# Altium project MainBoard.PrjPCB
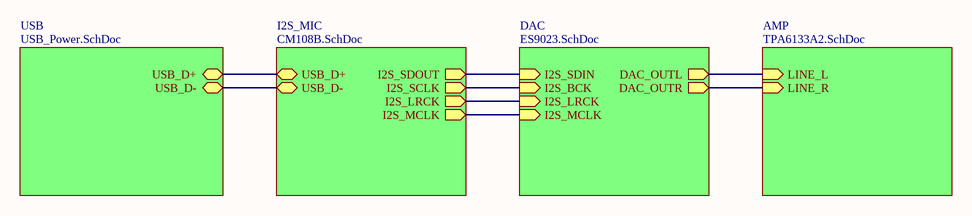
[diagram p0: Root.SchDoc]
5 sheets, 87 parts. Net scope: hierarchical (ports join the sheet entries above them; power ports are global).
Board file: MainBoard.PcbDoc
Sheets:
  Root.SchDoc
    USB = USB_Power.SchDoc
    I2S_MIC = CM108B.SchDoc
    AMP = TPA6133A2.SchDoc
    DAC = ES9023.SchDoc

## Sheet Root.SchDoc
size A4

### Sub-sheets
AMP = TPA6133A2.SchDoc: LINE_R (in), LINE_L (in)
DAC = ES9023.SchDoc: I2S_MCLK (in), I2S_LRCK (in), DAC_OUTL (out), DAC_OUTR (out), I2S_SDIN (in), I2S_BCK (in)
I2S_MIC = CM108B.SchDoc: USB_D-, I2S_SDOUT (out), USB_D+, I2S_MCLK (out), I2S_LRCK (out), I2S_SCLK (out)
USB = USB_Power.SchDoc: USB_D-, USB_D+

### Nets
BCK: sheet I2S_MIC/I2S_SCLK, sheet DAC/I2S_BCK
LRCK: sheet I2S_MIC/I2S_LRCK, sheet DAC/I2S_LRCK
MCLK: sheet I2S_MIC/I2S_MCLK, sheet DAC/I2S_MCLK
SDI: sheet I2S_MIC/I2S_SDOUT, sheet DAC/I2S_SDIN
NetC21_1: sheet AMP/LINE_L, sheet DAC/DAC_OUTL
NetC27_2: sheet AMP/LINE_R, sheet DAC/DAC_OUTR
NetESD1_6: sheet USB/USB_D+, sheet I2S_MIC/USB_D+
NetESD1_7: sheet USB/USB_D-, sheet I2S_MIC/USB_D-

## Sheet USB_Power.SchDoc
size A4
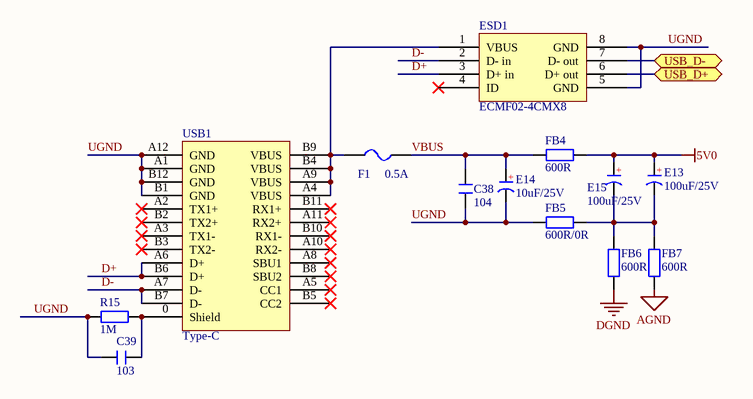
[diagram p1: USB_Power.SchDoc]

### Parts
C38  104  [C 0603_L]
C39  103  [C 0603_L]
E13  100uF/25V  [CD D(7343)]
E14  10uF/25V  [CD A(3216)]
E15  100uF/25V  [CD D(7343)]
ESD1  ECMF02-4CMX8  [QFN8L]
F1  0.5A  [FU 1206]
FB4  600R  [R 0805_L]
FB5  600R/0R  [R 0805_L]
FB6  600R  [R 0805_L]
FB7  600R  [R 0805_L]
R15  1M  [R 0603_L]
USB1  Type-C  [USB-TYPE-C_16PIN-MALE-TYPE-C-31-M-12]

### Ports
USB_D+, USB_D-

### Nets
5V0: E13.1(A) E15.1(A) FB4.2
AGND: FB7.1
DGND: FB6.1
D+: ESD1.3(D+_in) USB1.A6(D+) USB1.B6(D+)
D-: ESD1.2(D-_in) USB1.A7(D-) USB1.B7(D-)
UGND: C38.1 C39.2 E14.2(K) ESD1.5(GND) ESD1.8(GND) FB5.1 R15.2 USB1.A1(GND) USB1.A12(GND) USB1.B1(GND) USB1.B12(GND)
VBUS: C38.2 E14.1(A) F1.2 FB4.1
NetC39_1: C39.1 R15.1 USB1.0(Shield)
NetE13_2: E13.2(K) E15.2(K) FB5.2 FB6.2 FB7.2
NetESD1_1: ESD1.1(VBUS) F1.1 USB1.A4(VBUS) USB1.A9(VBUS) USB1.B4(VBUS) USB1.B9(VBUS)
NetESD1_6: ESD1.6(D+_out) ; port USB_D+
NetESD1_7: ESD1.7(D-_out) ; port USB_D-

Not connected (* = marked no-connect by the designer): ESD1 4(ID)*; USB1 A2(TX1+)* A3(TX1-)* A5(CC1)* A8(SBU1)* A10(RX2-)* A11(RX2+)* B2(TX2+)* B3(TX2-)* B5(CC2)* B8(SBU2)* B10(RX1-)* B11(RX1+)*

### Notes on the sheet
- (in symbol CT) +

### Library data of the parts
C38 C39 = C: 贴片电容; BOM名称: 无极性贴片电容; 优秀评价可免费更新: 联系淘宝ID：黄晶宝石，获取更新版封装库; 卖家免费技术支持，联系售后: 唯一出售店铺网址https://shop463601444.taobao.com; 本封装库来自淘宝卖家 ID：黄晶宝石: 其他店铺购入均为盗版，请立即申请退款
E13-E15 = CT: 贴片钽电容; 优秀评价可免费更新: 联系淘宝ID：黄晶宝石，获取更新版封装库; 卖家免费技术支持，联系售后: 唯一出售店铺网址https://shop463601444.taobao.com; 本封装库来自淘宝卖家 ID：黄晶宝石: 其他店铺购入均为盗版，请立即申请退款; BOM名称: 贴片钽电容
ESD1 = ECMF02-4CMX8: Common mode filter with ESD protection for USB 2.0 interface
F1 = FU: 贴片保险丝; 版权归属: 封装库来自淘宝卖家 ID：黄晶宝石; 优秀评价可免费更新: 联系淘宝ID：黄晶宝石，获取更新版封装库; 卖家免费技术支持，联系售后: 唯一出售店铺网址https://shop463601444.taobao.com; 封装库来自淘宝卖家 ID：黄晶宝石: 其他店铺购入均为盗版，请立即申请退款; BOM名称: 贴片保险丝
FB4-FB7 R15 = R: 贴片电阻; 优秀评价可免费更新: 联系淘宝ID：黄晶宝石，获取更新版封装库; 卖家免费技术支持，联系售后: 唯一出售店铺网址https://shop463601444.taobao.com; 本封装库来自淘宝卖家 ID：黄晶宝石: 其他店铺购入均为盗版，请立即申请退款; BOM名称: 贴片电阻

## Sheet CM108B.SchDoc
size A4
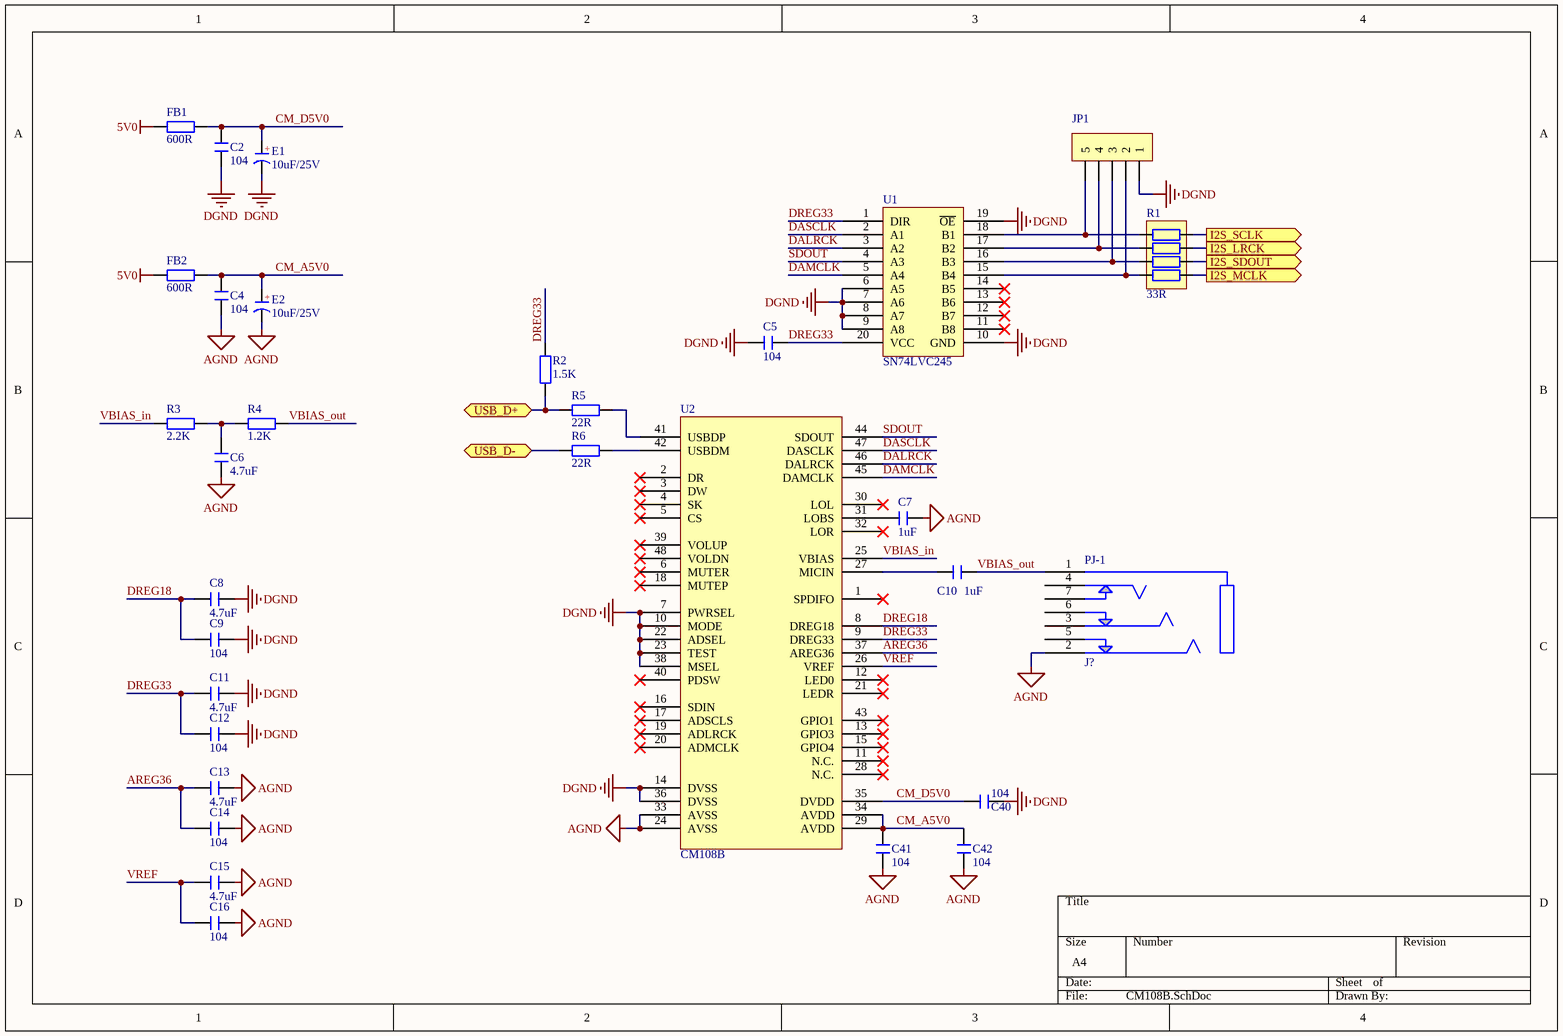
[diagram p2: CM108B.SchDoc]

### Parts
C2  104  [C 0603_L]
C4  104  [C 0603_L]
C5  104  [C 0603_L]
C6  4.7uF  [C 0603_L]
C7  1uF  [C 0603_L]
C8  4.7uF  [C 0603_L]
C9  104  [C 0603_L]
C10  1uF  [WIMA 1uF]
C11  4.7uF  [C 0603_L]
C12  104  [C 0603_L]
C13  4.7uF  [C 0603_L]
C14  104  [C 0603_L]
C15  4.7uF  [C 0603_L]
C16  104  [C 0603_L]
C40  104  [C 0603_L]
C41  104  [C 0603_L]
C42  104  [C 0603_L]
E1  10uF/25V  [CD A(3216)]
E2  10uF/25V  [CD A(3216)]
FB1  600R  [R 0805_L]
FB2  600R  [R 0805_L]
JP1  HDR-1X5  [HDR2.54-LI-5P]  (value not drawn)
PJ-1  J?  [PJ-393-7A]
R1  33R  [RCA-8P4R-0402]
R2  1.5K  [R 0603_L]
R3  2.2K  [R 0603_L]
R4  1.2K  [R 0603_L]
R5  22R  [R 0603_L]
R6  22R  [R 0603_L]
U1  SN74LVC245  [TSSOP20_N]
U2  CM108B  [LQFP48_N]

### Ports
I2S_LRCK (out), I2S_MCLK (out), I2S_SCLK (out), I2S_SDOUT (out), USB_D+, USB_D-

### Nets
5V0: FB1.1 FB2.1
AGND: C4.1 C6.2 C7.1 C13.1 C14.2 C15.1 C16.2 C41.2 C42.1 E2.2(K) PJ-1.2 U2.24(AVSS) U2.33(AVSS)
DGND: C2.1 C5.1 C8.1 C9.2 C11.1 C12.2 C40.2 E1.2(K) JP1.1 U1.6(A5) U1.7(A6) U1.8(A7) U1.9(A8) U1.10(GND) U1.19(~{OE}) U2.7(PWRSEL) U2.10(MODE) U2.14(DVSS) U2.22(ADSEL) U2.23(TEST) U2.36(DVSS) U2.38(MSEL)
AREG36: C13.2 C14.1 U2.37(AREG36)
BCK: R1.4 ; port I2S_SCLK
CM_A5V0: C4.2 C41.1 C42.2 E2.1(A) FB2.2 U2.29(AVDD) U2.34(AVDD)
CM_D5V0: C2.2 C40.1 E1.1(A) FB1.2 U2.35(DVDD)
DALRCK: U1.3(A2) U2.46(DALRCK)
DAMCLK: U1.5(A4) U2.45(DAMCLK)
DASCLK: U1.2(A1) U2.47(DASCLK)
DREG18: C8.2 C9.1 U2.8(DREG18)
DREG33: C5.2 C11.2 C12.1 R2.2 U1.1(DIR) U1.20(VCC) U2.9(DREG33)
LRCK: R1.3 ; port I2S_LRCK
MCLK: R1.1 ; port I2S_MCLK
SDI: R1.2 ; port I2S_SDOUT
SDOUT: U1.4(A3) U2.44(SDOUT)
VBIAS_in: R3.1 U2.25(VBIAS)
VBIAS_out: C10.2 PJ-1.1 R4.2
VREF: C15.2 C16.1 U2.26(VREF)
NetC6_1: C6.1 R3.2 R4.1
NetC7_2: C7.2 U2.31(LOBS)
NetC10_1: C10.1 U2.27(MICIN)
NetESD1_6: R2.1 R5.1 ; port USB_D+
NetESD1_7: R6.1 ; port USB_D-
NetJP1_2: JP1.2 R1.8 U1.15(B4)
NetJP1_3: JP1.3 R1.7 U1.16(B3)
NetJP1_4: JP1.4 R1.6 U1.17(B2)
NetJP1_5: JP1.5 R1.5 U1.18(B1)
NetR5_2: R5.2 U2.41(USBDP)
NetR6_2: R6.2 U2.42(USBDM)

Not connected (* = marked no-connect by the designer): PJ-1 3 4 5 6 7; U1 11(B8)* 12(B7)* 13(B6)* 14(B5)*; U2 1(SPDIFO)* 2(DR)* 3(DW)* 4(SK)* 5(CS)* 6(MUTER)* 11(N.C.)* 12(LED0)* 13(GPIO3)* 15(GPIO4)* 16(SDIN)* 17(ADSCLS)* 18(MUTEP)* 19(ADLRCK)* 20(ADMCLK)* 21(LEDR)* 28(N.C.)* 30(LOL)* 32(LOR)* 39(VOLUP)* 40(PDSW)* 43(GPIO1)* 48(VOLDN)*

### Notes on the sheet
- (in symbol CT) +

### Library data of the parts
C2 C4-C16 C40-C42 = C: as C38 on sheet USB_Power
E1 E2 = CT: as E13 on sheet USB_Power; BOM名称: 贴片钽电容
FB1 FB2 R2-R6 = R: as FB4 on sheet USB_Power; BOM名称: 贴片电阻
JP1 = Header 5: 5P接插件; 版权归属: 封装库来自淘宝 ID：黄晶宝石; 优秀评价可免费更新: 联系淘宝ID：黄晶宝石，获取更新版封装库; 卖家免费技术支持，联系售后: 唯一出售店铺网址https://shop463601444.taobao.com; BOM名称: 5P接插件
PJ-1 = PJ-393-7: 3.5mm 4段 耳机插座
R1 = R-8P4R: 贴片排阻; BOM名称: 贴片网络排阻; 优秀评价可免费更新: 联系淘宝ID：黄晶宝石，获取更新版封装库; 卖家免费技术支持，联系售后: 唯一出售店铺网址https://shop463601444.taobao.com; 本封装库来自淘宝卖家 ID：黄晶宝石: 其他店铺购入均为盗版，请立即申请退款
U2 = CM108B: USB

## Sheet TPA6133A2.SchDoc
size A4
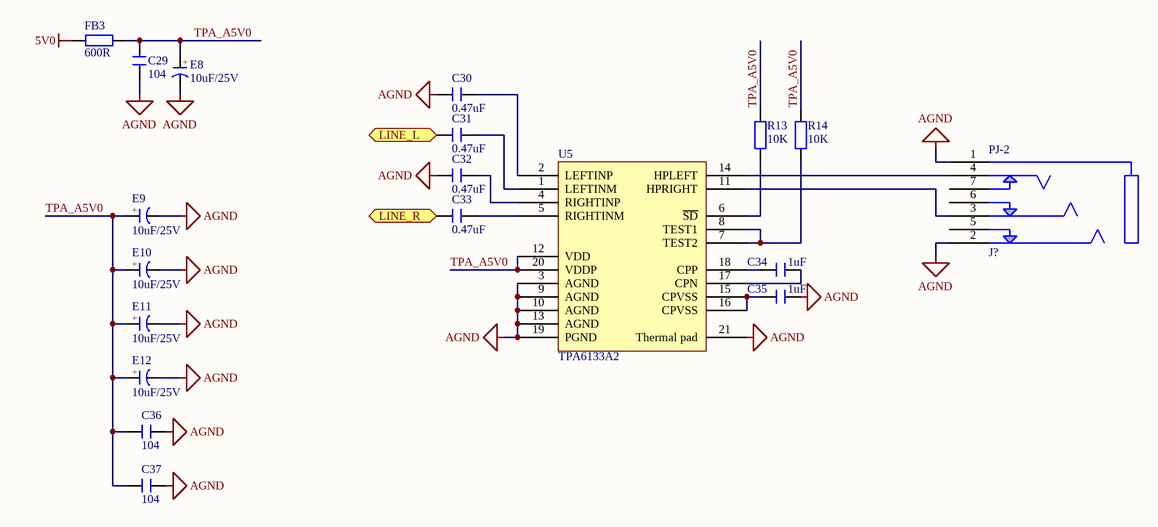
[diagram p3: TPA6133A2.SchDoc]

### Parts
C29  104  [C 0603_L]
C30  0.47uF  [WIMA 0.47uF]
C31  0.47uF  [WIMA 0.47uF]
C32  0.47uF  [WIMA 0.47uF]
C33  0.47uF  [WIMA 0.47uF]
C34  1uF  [C 0603_L]
C35  1uF  [C 0603_L]
C36  104  [C 0603_L]
C37  104  [C 0603_L]
E8  10uF/25V  [CD A(3216)]
E9  10uF/25V  [CD A(3216)]
E10  10uF/25V  [CD A(3216)]
E11  10uF/25V  [CD A(3216)]
E12  10uF/25V  [CD A(3216)]
FB3  600R  [R 0805_L]
PJ-2  J?  [PJ-393-7A]
R13  10K  [R 0603_L]
R14  10K  [R 0603_L]
U5  TPA6133A2  [QFN20 4x4_N]

### Ports
LINE_L (in), LINE_R (in)

### Nets
5V0: FB3.1
AGND: C29.1 C30.1 C32.1 C35.2 C36.1 C37.1 E8.2(K) E9.2(K) E10.2(K) E11.2(K) E12.2(K) PJ-2.1 PJ-2.2 U5.3(AGND) U5.9(AGND) U5.10(AGND) U5.13(AGND) U5.19(PGND) U5.21(Thermal_pad)
TPA_A5V0: C29.2 C36.2 C37.2 E8.1(A) E9.1(A) E10.1(A) E11.1(A) E12.1(A) FB3.2 R13.1 R14.1 U5.12(VDD) U5.20(VDDP)
NetC21_1: C31.1 ; port LINE_L
NetC27_2: C33.1 ; port LINE_R
NetC30_2: C30.2 U5.2(LEFTINP)
NetC31_2: C31.2 U5.1(LEFTINM)
NetC32_2: C32.2 U5.4(RIGHTINP)
NetC33_2: C33.2 U5.5(RIGHTINM)
NetC34_1: C34.1 U5.18(CPP)
NetC34_2: C34.2 U5.17(CPN)
NetC35_1: C35.1 U5.15(CPVSS) U5.16(CPVSS)
NetPJ-2_3: PJ-2.3 U5.11(HPRIGHT)
NetPJ-2_4: PJ-2.4 U5.14(HPLEFT)
NetR13_2: R13.2 U5.6(~{SD})
NetR14_2: R14.2 U5.7(TEST2) U5.8(TEST1)

Not connected (* = marked no-connect by the designer): PJ-2 5 6 7

### Notes on the sheet
- (in symbol CT) +

### Library data of the parts
C29-C37 = C: as C38 on sheet USB_Power
E8-E12 = CT: as E13 on sheet USB_Power; BOM名称: 贴片钽电容
FB3 R13 R14 = R: as FB4 on sheet USB_Power; BOM名称: 贴片电阻
PJ-2 = PJ-393-7: 3.5mm 4段 耳机插座

## Sheet ES9023.SchDoc
size A4
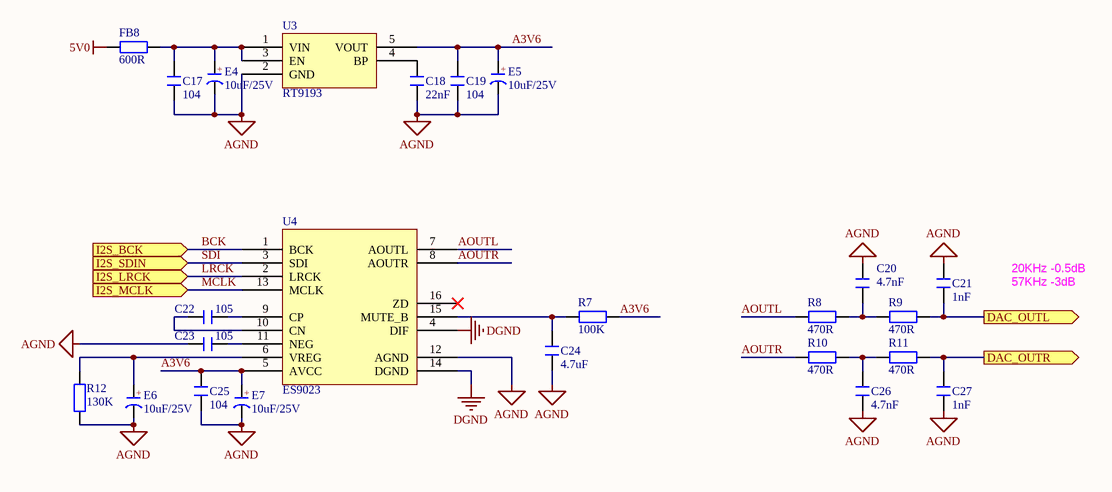
[diagram p4: ES9023.SchDoc]

### Parts
C17  104  [C 0603_L]
C18  22nF  [C 0603_L]
C19  104  [C 0603_L]
C20  4.7nF  [C 0603_L]
C21  1nF  [C 0603_L]
C22  105  [C 0603_L]
C23  105  [C 0603_L]
C24  4.7uF  [C 0603_L]
C25  104  [C 0603_L]
C26  4.7nF  [C 0603_L]
C27  1nF  [C 0603_L]
E4  10uF/25V  [CD A(3216)]
E5  10uF/25V  [CD A(3216)]
E6  10uF/25V  [CD A(3216)]
E7  10uF/25V  [CD A(3216)]
FB8  600R  [R 0805_L]
R7  100K  [R 0603_L]
R8  470R  [R 0603_L]
R9  470R  [R 0603_L]
R10  470R  [R 0603_L]
R11  470R  [R 0603_L]
R12  130K  [R 0603_L]
U3  RT9193  [SOT23-5N]
U4  ES9023  [SOP16_N]

### Ports
DAC_OUTL (out), DAC_OUTR (out), I2S_BCK (in), I2S_LRCK (in), I2S_MCLK (in), I2S_SDIN (in)

### Nets
5V0: FB8.1
AGND: C17.1 C18.1 C19.1 C20.2 C21.2 C23.2 C24.2 C25.1 C26.1 C27.1 E4.2(K) E5.2(K) E6.2(K) E7.2(K) R12.1 U3.2(GND) U4.12(AGND)
DGND: U4.4(DIF) U4.14(DGND)
A3V6: C19.2 C25.2 E5.1(A) E7.1(A) R7.1 U3.5(VOUT) U4.5(AVCC)
AOUTL: R8.2 U4.7(AOUTL)
AOUTR: R10.2 U4.8(AOUTR)
BCK: U4.1(BCK) ; port I2S_BCK
LRCK: U4.2(LRCK) ; port I2S_LRCK
MCLK: U4.13(MCLK) ; port I2S_MCLK
SDI: U4.3(SDI) ; port I2S_SDIN
NetC17_2: C17.2 E4.1(A) FB8.2 U3.1(VIN) U3.3(EN)
NetC18_2: C18.2 U3.4(BP)
NetC20_1: C20.1 R8.1 R9.2
NetC21_1: C21.1 R9.1 ; port DAC_OUTL
NetC22_1: C22.1 U4.9(CP)
NetC22_2: C22.2 U4.10(CN)
NetC23_1: C23.1 U4.11(NEG)
NetC24_1: C24.1 R7.2 U4.15(MUTE_B)
NetC26_2: C26.2 R10.1 R11.2
NetC27_2: C27.2 R11.1 ; port DAC_OUTR
NetE6_1: E6.1(A) R12.2 U4.6(VREG)

Not connected (* = marked no-connect by the designer): U4 16(ZD)*

### Notes on the sheet
- 20KHz -0.5dB
- 57KHz -3dB
- (in symbol CT) +

### Library data of the parts
C17-C27 = C: as C38 on sheet USB_Power
E4-E7 = CT: as E13 on sheet USB_Power; BOM名称: 贴片钽电容
FB8 R7-R12 = R: as FB4 on sheet USB_Power; BOM名称: 贴片电阻
U3 = RT9193: 高PSRR低噪声高速稳压
U4 = ES9023: 24bit DAC 2Vrms

## Nets that join several sheets
5V0: USB_Power (E13.1 E15.1 FB4.2), CM108B (FB1.1 FB2.1), TPA6133A2 (FB3.1), ES9023 (FB8.1)
AGND: USB_Power (FB7.1), CM108B (13 pins), TPA6133A2 (19 pins), ES9023 (17 pins)
DGND: USB_Power (FB6.1), CM108B (22 pins), ES9023 (U4.4 U4.14)
BCK: CM108B (R1.4), ES9023 (U4.1)
LRCK: CM108B (R1.3), ES9023 (U4.2)
MCLK: CM108B (R1.1), ES9023 (U4.13)
NetC21_1: TPA6133A2 (C31.1), ES9023 (C21.1 R9.1)
NetC27_2: TPA6133A2 (C33.1), ES9023 (C27.2 R11.1)
NetESD1_6: USB_Power (ESD1.6), CM108B (R2.1 R5.1)
NetESD1_7: USB_Power (ESD1.7), CM108B (R6.1)
SDI: CM108B (R1.2), ES9023 (U4.3)